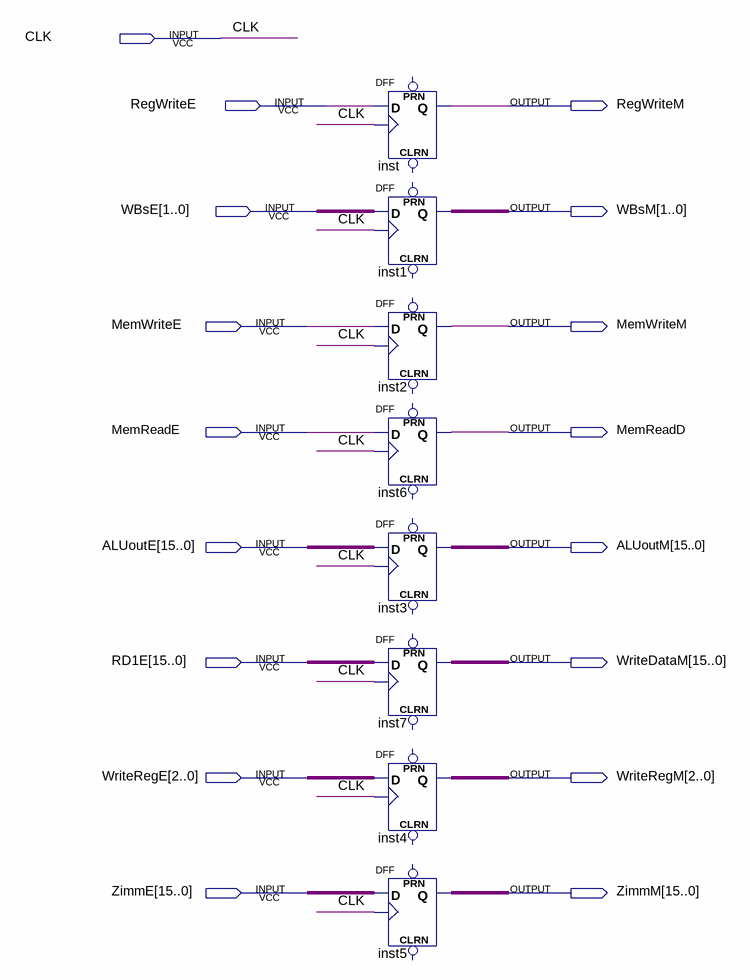
[diagram p0: schematic sheet]
// Quartus schematic E_M.bdf as structural Verilog: 8 symbols, 17 pins
module E_M (
  input  CLK,
  input  RegWriteE,
  input  [1:0] WBsE,
  input  MemWriteE,
  input  MemReadE,
  input  [15:0] ALUoutE,
  input  [15:0] RD1E,
  input  [2:0] WriteRegE,
  input  [15:0] ZimmE,
  output RegWriteM,
  output [1:0] WBsM,
  output MemWriteM,
  output MemReadD,
  output [15:0] ALUoutM,
  output [15:0] WriteDataM,
  output [2:0] WriteRegM,
  output [15:0] ZimmM
);

  DFF inst (.CLK(CLK), .D(RegWriteE), .Q(RegWriteM));  // open: CLRN, PRN
  DFF inst1[1:0] (.CLK(CLK), .D(WBsE), .Q(WBsM));  // open: CLRN, PRN
  DFF inst2 (.CLK(CLK), .D(MemWriteE), .Q(MemWriteM));  // open: CLRN, PRN
  DFF inst6 (.CLK(CLK), .D(MemReadE), .Q(MemReadD));  // open: CLRN, PRN
  DFF inst3[15:0] (.CLK(CLK), .D(ALUoutE), .Q(ALUoutM));  // open: CLRN, PRN
  DFF inst7[15:0] (.CLK(CLK), .D(RD1E), .Q(WriteDataM));  // open: CLRN, PRN
  DFF inst4[2:0] (.CLK(CLK), .D(WriteRegE), .Q(WriteRegM));  // open: CLRN, PRN
  DFF inst5[15:0] (.CLK(CLK), .D(ZimmE), .Q(ZimmM));  // open: CLRN, PRN
endmodule
